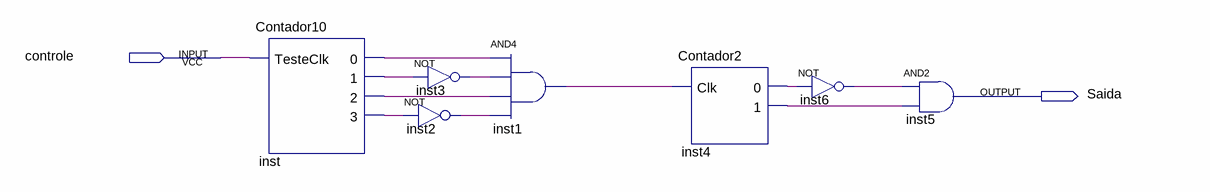
[diagram p0: schematic sheet]
// Quartus schematic FimJogo.bdf as structural Verilog: 7 symbols, 2 pins
module FimJogo (
  input  controle,
  output Saida
);

  wire inst1_out, inst2_out, inst3_out, inst4_0, inst4_1, inst6_out, inst_0, inst_1, inst_2, inst_3;

  Contador10 inst (.TesteClk(controle), .\0 (inst_0), .\1 (inst_1), .\2 (inst_2), .\3 (inst_3));
  not inst3 (inst3_out, inst_1);
  not inst2 (inst2_out, inst_3);
  and inst1 (inst1_out, inst_0, inst3_out, inst_2, inst2_out);
  Contador2 inst4 (.Clk(inst1_out), .\0 (inst4_0), .\1 (inst4_1));
  not inst6 (inst6_out, inst4_0);
  and inst5 (Saida, inst6_out, inst4_1);
endmodule
